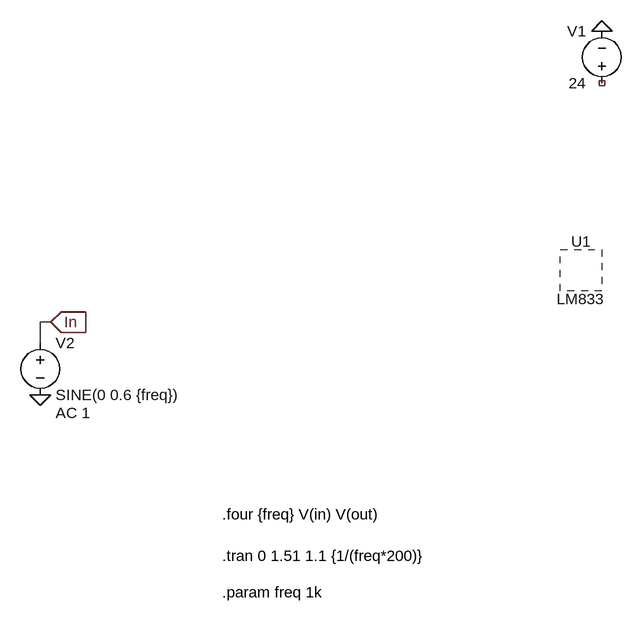
[diagram p0: schematic tone_control.asc]
tone_control.asc, the LTspice schematic file:
Version 4
SHEET 1 880 680
WIRE -912 208 -928 208
WIRE -928 240 -928 208
FLAG -64 -240 0
FLAG -912 208 In
IOPIN -912 208 In
FLAG -928 320 0
SYMBOL voltage -64 -144 R180
WINDOW 0 24 96 Left 2
WINDOW 3 24 16 Left 2
SYMATTR InstName V1
SYMATTR Value 24
SYMBOL voltage -928 224 R0
WINDOW 123 24 124 Left 2
WINDOW 39 0 0 Left 0
SYMATTR Value2 AC 1
SYMATTR InstName V2
SYMATTR Value SINE(0 0.6 {freq})
SYMBOL OpAmps\\LM833 -96 128 R0
SYMATTR InstName U1
TEXT -648 568 Left 2 !.tran 0 1.51 1.1 {1/(freq*200)}
TEXT -648 504 Left 2 !.four {freq} V(in) V(out)
TEXT -648 624 Left 2 !.param freq 1k

The netlist it stands for:
* tone_control.asc
V1 NC_01 0 24
V2 In 0 SINE(0 0.6 {freq}) AC 1
* U1: LM833 (symbol OpAmps\LM833 not available, pin order unknown); nets seen at it: 
.tran 0 1.51 1.1 {1/(freq*200)}
.four {freq} V(in) V(out)
.param freq 1k
.backanno
.end